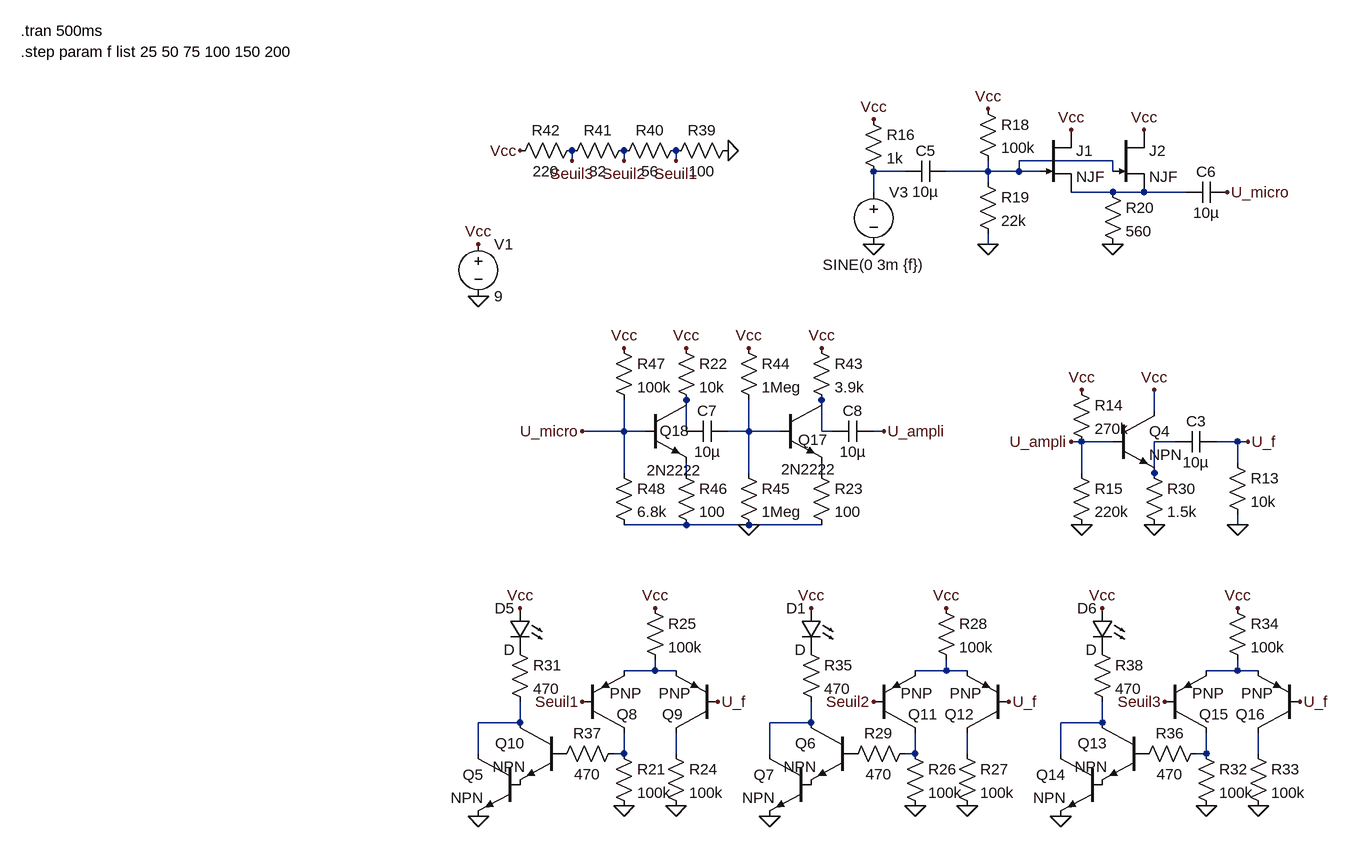
[diagram p0: schematic Sound-meter_experimental.asc]
Sound-meter_experimental.asc, the LTspice schematic file:
Version 4
SHEET 1 4624 1596
WIRE 0 400 0 384
WIRE 80 400 80 384
WIRE 160 400 160 384
WIRE 832 400 688 400
WIRE 512 416 464 416
WIRE 640 416 640 400
WIRE 640 416 576 416
WIRE 688 416 688 400
WIRE 688 416 640 416
WIRE 720 416 688 416
WIRE 832 416 832 400
WIRE 640 432 640 416
WIRE 464 448 464 416
WIRE 832 448 768 448
WIRE 880 448 832 448
WIRE 944 448 880 448
WIRE 640 528 640 512
WIRE 896 784 896 752
WIRE 80 816 80 768
WIRE 80 816 16 816
WIRE 112 816 80 816
WIRE 176 816 176 768
WIRE 272 816 272 768
WIRE 272 816 240 816
WIRE 320 816 272 816
WIRE 384 816 384 768
WIRE 400 816 384 816
WIRE 480 816 464 816
WIRE 784 832 768 832
WIRE 832 832 784 832
WIRE 928 832 896 832
WIRE 1024 832 992 832
WIRE 1040 832 1024 832
WIRE 1024 864 1024 832
WIRE 80 880 80 816
WIRE 176 880 176 864
WIRE 272 880 272 816
WIRE 384 880 384 864
WIRE 784 880 784 832
WIRE 896 880 896 832
WIRE 176 960 80 960
WIRE 272 960 176 960
WIRE 384 960 272 960
WIRE 1024 960 1024 944
WIRE 128 1184 128 1168
WIRE 128 1184 80 1184
WIRE 160 1184 128 1184
WIRE 576 1184 576 1168
WIRE 576 1184 528 1184
WIRE 608 1184 576 1184
WIRE 1024 1184 1024 1168
WIRE 1024 1184 976 1184
WIRE 1056 1184 1024 1184
WIRE -80 1264 -80 1232
WIRE -80 1264 -144 1264
WIRE 368 1264 368 1232
WIRE 368 1264 304 1264
WIRE 816 1264 816 1232
WIRE 816 1264 752 1264
WIRE -144 1312 -144 1264
WIRE 80 1312 80 1280
WIRE 80 1312 64 1312
WIRE 160 1312 160 1280
WIRE 304 1312 304 1264
WIRE 528 1312 528 1280
WIRE 528 1312 512 1312
WIRE 608 1312 608 1280
WIRE 752 1312 752 1264
WIRE 976 1312 976 1280
WIRE 976 1312 960 1312
WIRE 1056 1312 1056 1280
FLAG -144 528 Vcc
FLAG -144 608 0
FLAG 1024 960 0
FLAG 896 752 Vcc
FLAG 784 752 Vcc
FLAG 896 960 0
FLAG 784 960 0
FLAG 768 832 U_ampli
FLAG 80 1392 0
FLAG 128 1088 Vcc
FLAG 160 1392 0
FLAG 528 1392 0
FLAG 576 1088 Vcc
FLAG 464 1232 Seuil2
FLAG 608 1392 0
FLAG 976 1392 0
FLAG 1024 1088 Vcc
FLAG 912 1232 Seuil3
FLAG 1056 1392 0
FLAG 224 1232 U_f
FLAG -80 1088 Vcc
FLAG 368 1088 Vcc
FLAG 816 1088 Vcc
FLAG 672 1232 U_f
FLAG 1120 1232 U_f
FLAG 240 384 0
FLAG -80 384 Vcc
FLAG 16 1232 Seuil1
FLAG 1040 832 U_f
FLAG -144 1408 0
FLAG 304 1408 0
FLAG 752 1408 0
FLAG 160 400 Seuil1
FLAG 80 400 Seuil2
FLAG 0 400 Seuil3
FLAG 464 528 0
FLAG 464 336 Vcc
FLAG 640 528 0
FLAG 640 320 Vcc
FLAG 768 352 Vcc
FLAG 880 352 Vcc
FLAG 832 528 0
FLAG 1008 448 U_micro
FLAG 80 688 Vcc
FLAG 176 688 Vcc
FLAG 384 688 Vcc
FLAG 272 688 Vcc
FLAG 16 816 U_micro
FLAG 480 816 U_ampli
FLAG 272 960 0
SYMBOL voltage -144 512 R0
WINDOW 123 0 0 Left 0
WINDOW 39 0 0 Left 0
SYMATTR InstName V1
SYMATTR Value 9
SYMBOL cap 992 816 R90
WINDOW 0 0 32 VBottom 2
WINDOW 3 32 32 VTop 2
SYMATTR InstName C3
SYMATTR Value 10µ
SYMBOL res 1008 848 R0
SYMATTR InstName R13
SYMATTR Value 10k
SYMBOL res 768 736 R0
SYMATTR InstName R14
SYMATTR Value 270k
SYMBOL res 768 864 R0
SYMATTR InstName R15
SYMATTR Value 220k
SYMBOL res 880 864 R0
SYMATTR InstName R30
SYMATTR Value 1.5k
SYMBOL npn 832 784 R0
SYMATTR InstName Q4
SYMBOL pnp 16 1280 M180
WINDOW 0 53 29 Left 2
WINDOW 3 42 61 Left 2
SYMATTR InstName Q8
SYMBOL pnp 224 1280 R180
WINDOW 0 53 29 Left 2
WINDOW 3 42 61 Left 2
SYMATTR InstName Q9
SYMBOL res 64 1296 R0
SYMATTR InstName R21
SYMATTR Value 100k
SYMBOL res 144 1296 R0
SYMATTR InstName R24
SYMATTR Value 100k
SYMBOL res 112 1072 R0
SYMATTR InstName R25
SYMATTR Value 100k
SYMBOL npn -16 1264 M0
SYMATTR InstName Q10
SYMBOL LED -64 1088 M0
SYMATTR InstName D5
SYMBOL pnp 464 1280 M180
WINDOW 0 53 29 Left 2
WINDOW 3 42 61 Left 2
SYMATTR InstName Q11
SYMBOL pnp 672 1280 R180
WINDOW 0 53 29 Left 2
WINDOW 3 42 61 Left 2
SYMATTR InstName Q12
SYMBOL res 512 1296 R0
SYMATTR InstName R26
SYMATTR Value 100k
SYMBOL res 592 1296 R0
SYMATTR InstName R27
SYMATTR Value 100k
SYMBOL res 560 1072 R0
SYMATTR InstName R28
SYMATTR Value 100k
SYMBOL res 528 1296 R90
WINDOW 0 0 56 VBottom 2
WINDOW 3 32 56 VTop 2
SYMATTR InstName R29
SYMATTR Value 470
SYMBOL pnp 912 1280 M180
WINDOW 0 53 29 Left 2
WINDOW 3 42 61 Left 2
SYMATTR InstName Q15
SYMBOL pnp 1120 1280 R180
WINDOW 0 53 29 Left 2
WINDOW 3 42 61 Left 2
SYMATTR InstName Q16
SYMBOL res 960 1296 R0
SYMATTR InstName R32
SYMATTR Value 100k
SYMBOL res 1040 1296 R0
SYMATTR InstName R33
SYMATTR Value 100k
SYMBOL res 1008 1072 R0
SYMATTR InstName R34
SYMATTR Value 100k
SYMBOL res 976 1296 R90
WINDOW 0 0 56 VBottom 2
WINDOW 3 32 56 VTop 2
SYMATTR InstName R36
SYMATTR Value 470
SYMBOL res 80 1296 R90
WINDOW 0 0 56 VBottom 2
WINDOW 3 32 56 VTop 2
SYMATTR InstName R37
SYMATTR Value 470
SYMBOL res -96 1136 R0
SYMATTR InstName R31
SYMATTR Value 470
SYMBOL LED 384 1088 M0
SYMATTR InstName D1
SYMBOL res 352 1136 R0
SYMATTR InstName R35
SYMATTR Value 470
SYMBOL LED 832 1088 M0
SYMATTR InstName D6
SYMBOL res 800 1136 R0
SYMATTR InstName R38
SYMATTR Value 470
SYMBOL res 144 400 R270
WINDOW 0 32 56 VTop 2
WINDOW 3 0 56 VBottom 2
SYMATTR InstName R39
SYMATTR Value 100
SYMBOL res 64 400 R270
WINDOW 0 32 56 VTop 2
WINDOW 3 0 56 VBottom 2
SYMATTR InstName R40
SYMATTR Value 56
SYMBOL res -16 400 R270
WINDOW 0 32 56 VTop 2
WINDOW 3 0 56 VBottom 2
SYMATTR InstName R41
SYMATTR Value 82
SYMBOL res -96 400 R270
WINDOW 0 32 56 VTop 2
WINDOW 3 0 56 VBottom 2
SYMATTR InstName R42
SYMATTR Value 220
SYMBOL npn -80 1312 M0
SYMATTR InstName Q5
SYMBOL npn 432 1264 M0
SYMATTR InstName Q6
SYMBOL npn 368 1312 M0
SYMATTR InstName Q7
SYMBOL npn 880 1264 M0
SYMATTR InstName Q13
SYMBOL npn 816 1312 M0
SYMATTR InstName Q14
SYMBOL voltage 464 432 R0
WINDOW 123 0 0 Left 0
WINDOW 39 0 0 Left 0
WINDOW 3 -78 128 Left 2
SYMATTR Value SINE(0 3m {f})
SYMATTR InstName V3
SYMBOL res 448 320 R0
SYMATTR InstName R16
SYMATTR Value 1k
SYMBOL cap 576 400 R90
WINDOW 0 0 32 VBottom 2
WINDOW 3 32 32 VTop 2
SYMATTR InstName C5
SYMATTR Value 10µ
SYMBOL res 624 304 R0
SYMATTR InstName R18
SYMATTR Value 100k
SYMBOL res 624 416 R0
SYMATTR InstName R19
SYMATTR Value 22k
SYMBOL njf 720 352 R0
SYMATTR InstName J1
SYMBOL njf 832 352 R0
SYMATTR InstName J2
SYMBOL res 816 432 R0
SYMATTR InstName R20
SYMATTR Value 560
SYMBOL cap 1008 432 R90
WINDOW 0 0 32 VBottom 2
WINDOW 3 32 32 VTop 2
SYMATTR InstName C6
SYMATTR Value 10µ
SYMBOL res 160 672 R0
SYMATTR InstName R22
SYMATTR Value 10k
SYMBOL cap 240 800 R90
WINDOW 0 0 32 VBottom 2
WINDOW 3 32 32 VTop 2
SYMATTR InstName C7
SYMATTR Value 10µ
SYMBOL cap 464 800 R90
WINDOW 0 0 32 VBottom 2
WINDOW 3 32 32 VTop 2
SYMATTR InstName C8
SYMATTR Value 10µ
SYMBOL npn 320 768 R0
WINDOW 0 28 61 Left 2
WINDOW 3 2 106 Left 2
SYMATTR InstName Q17
SYMATTR Value 2N2222
SYMBOL res 368 864 R0
SYMATTR InstName R23
SYMATTR Value 100
SYMBOL res 368 672 R0
SYMATTR InstName R43
SYMATTR Value 3.9k
SYMBOL res 256 672 R0
SYMATTR InstName R44
SYMATTR Value 1Meg
SYMBOL res 256 864 R0
SYMATTR InstName R45
SYMATTR Value 1Meg
SYMBOL npn 112 768 R0
WINDOW 0 23 47 Left 2
WINDOW 3 3 108 Left 2
SYMATTR InstName Q18
SYMATTR Value 2N2222
SYMBOL res 160 864 R0
SYMATTR InstName R46
SYMATTR Value 100
SYMBOL res 64 672 R0
SYMATTR InstName R47
SYMATTR Value 100k
SYMBOL res 64 864 R0
SYMATTR InstName R48
SYMATTR Value 6.8k
TEXT -848 200 Left 2 !.tran 500ms
TEXT -848 232 Left 2 !.step param f list 25 50 75 100 150 200

The netlist it stands for:
* Sound-meter_experimental.asc
V1 Vcc 0 9
C3 U_f N007 10µ
R13 U_f 0 10k
R14 Vcc U_ampli 270k
R15 U_ampli 0 220k
R30 N007 0 1.5k
Q4 Vcc U_ampli N007 0 NPN
Q8 N016 Seuil1 N010 0 PNP
Q9 N017 U_f N010 0 PNP
R21 N016 0 100k
R24 N017 0 100k
R25 Vcc N010 100k
Q10 N013 P001 P002 0 NPN
D5 Vcc P003 D
Q11 N018 Seuil2 N011 0 PNP
Q12 N019 U_f N011 0 PNP
R26 N018 0 100k
R27 N019 0 100k
R28 Vcc N011 100k
R29 N018 P004 470
Q15 N020 Seuil3 N012 0 PNP
Q16 N021 U_f N012 0 PNP
R32 N020 0 100k
R33 N021 0 100k
R34 Vcc N012 100k
R36 N020 P005 470
R37 N016 P001 470
R31 P003 N013 470
D1 Vcc P006 D
R35 P006 N014 470
D6 Vcc P007 D
R38 P007 N015 470
R39 Seuil1 0 100
R40 Seuil2 Seuil1 56
R41 Seuil3 Seuil2 82
R42 Vcc Seuil3 220
Q5 N013 P002 0 0 NPN
Q6 N014 P004 P008 0 NPN
Q7 N014 P008 0 0 NPN
Q13 N015 P005 P009 0 NPN
Q14 N015 P009 0 0 NPN
V3 N002 0 SINE(0 3m {f})
R16 Vcc N002 1k
C5 N001 N002 10µ
R18 Vcc N001 100k
R19 N001 0 22k
J1 Vcc N001 N003 NJF
J2 Vcc N001 N003 NJF
R20 N003 0 560
C6 U_micro N003 10µ
R22 Vcc N004 10k
C7 N005 N004 10µ
C8 U_ampli N006 10µ
Q17 N006 N005 N009 0 2N2222
R23 N009 0 100
R43 Vcc N006 3.9k
R44 Vcc N005 1Meg
R45 N005 0 1Meg
Q18 N004 U_micro N008 0 2N2222
R46 N008 0 100
R47 Vcc U_micro 100k
R48 U_micro 0 6.8k
.model D D
.lib standard.dio
.model NPN NPN
.model PNP PNP
.lib standard.bjt
.model NJF NJF
.model PJF PJF
.lib standard.jft
.tran 500ms
.step param f list 25 50 75 100 150 200
.backanno
.end